# EAGLE schematic Aktivfilter (EAGLE 9.6.2)
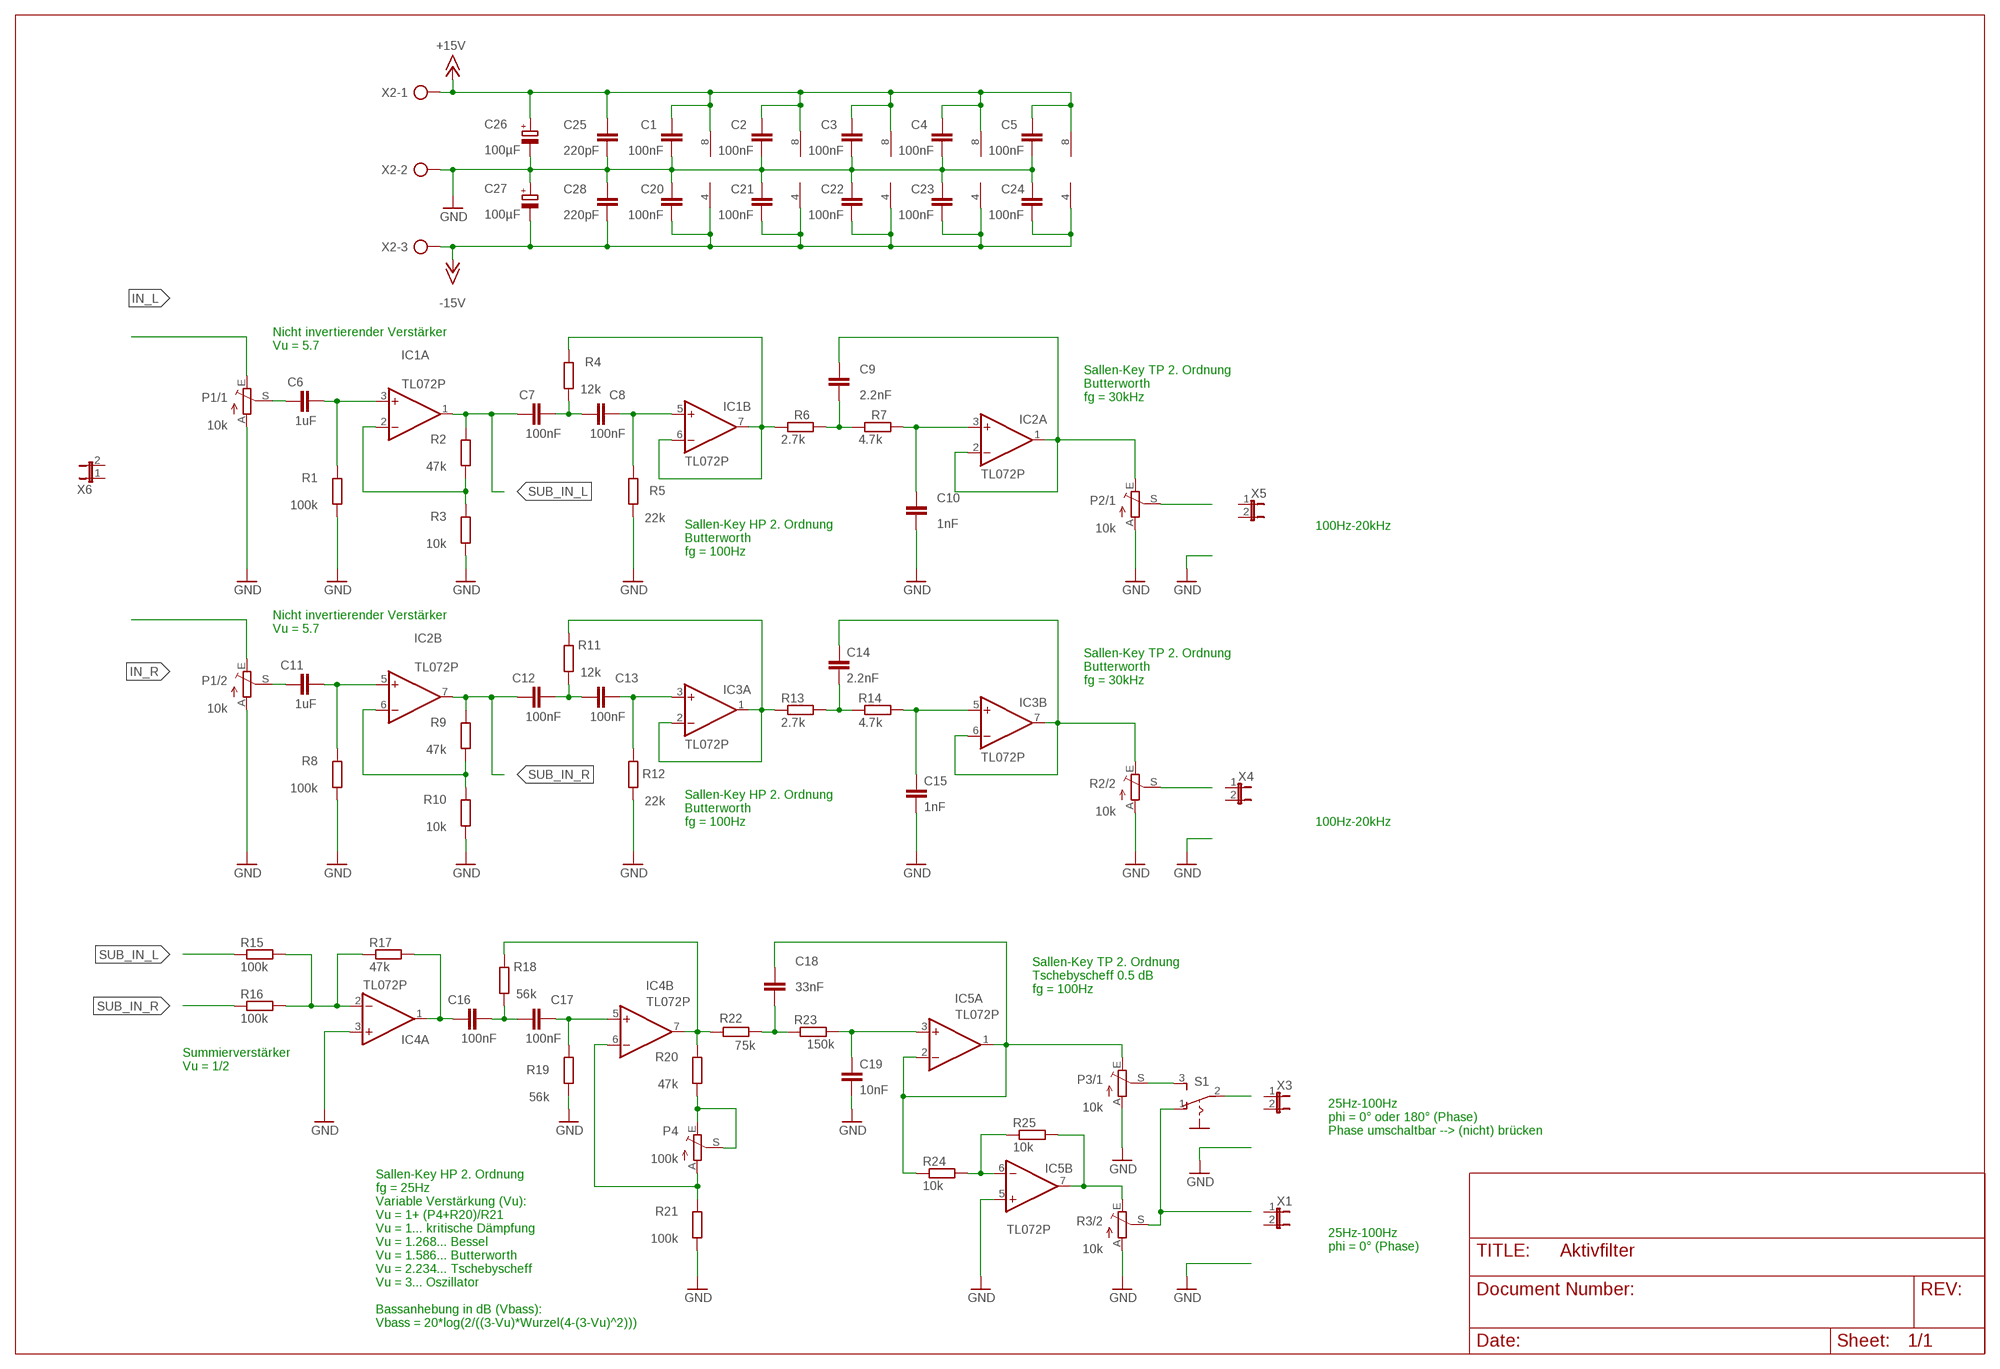
[diagram p0: schematic, sheet 1]

## Parts
C1  100nF  C-EU025-025X050  [C025-025X050]
C2  100nF  C-EU025-025X050  [C025-025X050]
C3  100nF  C-EU025-025X050  [C025-025X050]
C4  100nF  C-EU025-025X050  [C025-025X050]
C5  100nF  C-EU025-025X050  [C025-025X050]
C6  1uF  C-EU025-025X050  [C025-025X050]
C7  100nF  C-EU025-025X050  [C025-025X050]
C8  100nF  C-EU025-025X050  [C025-025X050]
C9  2.2nF  C-EU025-025X050  [C025-025X050]
C10  1nF  C-EU025-025X050  [C025-025X050]
C11  1uF  C-EU025-025X050  [C025-025X050]
C12  100nF  C-EU025-025X050  [C025-025X050]
C13  100nF  C-EU025-025X050  [C025-025X050]
C14  2.2nF  C-EU025-025X050  [C025-025X050]
C15  1nF  C-EU025-025X050  [C025-025X050]
C16  100nF  C-EU050-025X075  [C050-025X075]
C17  100nF  C-EU025-025X050  [C025-025X050]
C18  33nF  C-EU025-025X050  [C025-025X050]
C19  10nF  C-EU025-025X050  [C025-025X050]
C20  100nF  C-EU025-025X050  [C025-025X050]
C21  100nF  C-EU025-025X050  [C025-025X050]
C22  100nF  C-EU025-025X050  [C025-025X050]
C23  100nF  C-EU025-025X050  [C025-025X050]
C24  100nF  C-EU025-025X050  [C025-025X050]
C25  220pF  C-EU025-025X050  [C025-025X050]
C26  100µF  CPOL-EUE2.5-6  [E2,5-6]
C27  100µF  CPOL-EUE2.5-6  [E2,5-6]
C28  220pF  C-EU025-025X050  [C025-025X050]
IC1  TL072P  [DIL08]
IC2  TL072P  [DIL08]
IC3  TL072P  [DIL08]
IC4  TL072P  [DIL08]
IC5  TL072P  [DIL08]
P1/1  10k  TRIM_EU-B64Y  [B64Y]
P1/2  10k  TRIM_EU-B64Y  [B64Y]
P2/1  10k  TRIM_EU-B64Y  [B64Y]
P3/1  10k  TRIM_EU-B64Y  [B64Y]
P4  100k  TRIM_EU-B64Y  [B64Y]
R1  100k  R-EU_0207/10  [0207/10]
R2  47k  R-EU_0207/10  [0207/10]
R2/2  10k  TRIM_EU-B64Y  [B64Y]
R3  10k  R-EU_0207/10  [0207/10]
R3/2  10k  TRIM_EU-B64Y  [B64Y]
R4  12k  R-EU_0207/10  [0207/10]
R5  22k  R-EU_0207/10  [0207/10]
R6  2.7k  R-EU_0207/10  [0207/10]
R7  4.7k  R-EU_0207/10  [0207/10]
R8  100k  R-EU_0207/7  [0207/7]
R9  47k  R-EU_0207/7  [0207/7]
R10  10k  R-EU_0207/10  [0207/10]
R11  12k  R-EU_0207/10  [0207/10]
R12  22k  R-EU_0207/10  [0207/10]
R13  2.7k  R-EU_0207/10  [0207/10]
R14  4.7k  R-EU_0207/10  [0207/10]
R15  100k  R-EU_0207/10  [0207/10]
R16  100k  R-EU_0207/10  [0207/10]
R17  47k  R-EU_0207/10  [0207/10]
R18  56k  R-EU_0207/10  [0207/10]
R19  56k  R-EU_0207/7  [0207/7]
R20  47k  R-EU_0207/10  [0207/10]
R21  100k  R-EU_0207/10  [0207/10]
R22  75k  R-EU_0207/7  [0207/7]
R23  150k  R-EU_0207/10  [0207/10]
R24  10k  R-EU_0207/10  [0207/10]
R25  10k  R-EU_0207/10  [0207/10]
S1  255SB  [255SB]
X1  JMP2  [JMP2]
X2  AK300/3  [AK300/3]
X3  JMP2  [JMP2]
X4  JMP2  [JMP2]
X5  JMP2  [JMP2]
X6  JMP2  [JMP2]

## Nets
+15V: C1.1 C2.1 C3.1 C4.1 C5.1 C25.1 C26.+ IC1.8(P:V+) IC2.8(P:V+) IC3.8(P:V+) IC4.8(P:V+) IC5.8(P:V+) X2.1
-15V: C20.2 C21.2 C22.2 C23.2 C24.2 C27.- C28.2 IC1.4(P:V-) IC2.4(P:V-) IC3.4(P:V-) IC4.4(P:V-) IC5.4(P:V-) X2.3
GND: C1.2 C2.2 C3.2 C4.2 C5.2 C10.2 C15.2 C19.2 C20.1 C21.1 C22.1 C23.1 C24.1 C25.2 C26.- C27.+ C28.1 IC4.3(A:+IN) IC5.5(B:+IN) P1/1.A P1/2.A P2/1.A P3/1.A R1.1 R2/2.A R3.1 R3/2.A R5.1 R8.1 R10.1 R12.1 R19.1 R21.1 X2.2
IN_L: P1/1.E
IN_R: P1/2.E
N$1: P3/1.S S1.3(S)
N$2: R3/2.S S1.1(O)
N$3: S1.2(P)
N$26: C6.1 P1/1.S
N$28: C6.2 IC1.3(A:+IN) R1.2
N$31: IC1.2(A:-IN) R2.1 R3.2
N$33: IC1.6(B:-IN) IC1.7(B:OUT) R4.2 R6.1
N$34: C8.2 IC1.5(B:+IN) R5.2
N$35: C7.2 C8.1 R4.1
N$36: IC4.2(A:-IN) R15.2 R16.2 R17.1
N$37: C9.2 R6.2 R7.1
N$38: C10.1 IC2.3(A:+IN) R7.2
N$39: C9.1 IC2.1(A:OUT) IC2.2(A:-IN) P2/1.E
N$40: C16.1 IC4.1(A:OUT) R17.2
N$41: C11.1 P1/2.S
N$42: C11.2 IC2.5(B:+IN) R8.2
N$43: IC2.6(B:-IN) R9.1 R10.2
N$45: IC3.1(A:OUT) IC3.2(A:-IN) R11.2 R13.1
N$46: C13.2 IC3.3(A:+IN) R12.2
N$47: C12.2 C13.1 R11.1
N$48: C14.2 R13.2 R14.1
N$49: C15.1 IC3.5(B:+IN) R14.2
N$50: C14.1 IC3.6(B:-IN) IC3.7(B:OUT) R2/2.E
N$51: C16.2 C17.1 R18.1
N$52: C17.2 IC4.5(B:+IN) R19.2
N$53: IC4.7(B:OUT) R18.2 R20.2 R22.2
N$54: IC4.6(B:-IN) P4.A R21.2
N$55: IC5.6(B:-IN) R24.2 R25.1
N$57: P4.E P4.S R20.1
N$59: C19.1 IC5.3(A:+IN) R23.2
N$60: C18.2 R22.1 R23.1
OUT_L: P2/1.S
OUT_R: R2/2.S
SUB_IN_L: C7.1 IC1.1(A:OUT) R2.2 R15.1
SUB_IN_R: C12.1 IC2.7(B:OUT) R9.2 R16.1
SUB_OUT: IC5.7(B:OUT) R3/2.E R25.2
SUB_OUT-180: C18.1 IC5.1(A:OUT) IC5.2(A:-IN) P3/1.E R24.1
Unconnected: X1.1 X1.2 X3.1 X3.2 X4.1 X4.2 X5.1 X5.2 X6.1 X6.2

## Notes on the sheet
- Nicht invertierender Verstärker
  Vu = 5.7
- Sallen-Key TP 2. Ordnung
  Butterworth
  fg = 30kHz
- 100Hz-20kHz
- Sallen-Key HP 2. Ordnung
  Butterworth
  fg = 100Hz
- Nicht invertierender Verstärker
  Vu = 5.7
- Sallen-Key TP 2. Ordnung
  Butterworth
  fg = 30kHz
- Sallen-Key HP 2. Ordnung
  Butterworth
  fg = 100Hz
- 100Hz-20kHz
- Sallen-Key TP 2. Ordnung
  Tschebyscheff 0.5 dB
  fg = 100Hz
- Summierverstärker
  Vu = 1/2
- 25Hz-100Hz
  phi = 0° oder 180° (Phase) 
  Phase umschaltbar --> (nicht) brücken
- 25Hz-100Hz
  phi = 0° (Phase)
- Sallen-Key HP 2. Ordnung
  fg = 25Hz
  Variable Verstärkung (Vu): 
  Vu = 1+ (P4+R20)/R21
  Vu = 1... kritische Dämpfung
  Vu = 1.268... Bessel
  Vu = 1.586... Butterworth
  Vu = 2.234... Tschebyscheff
  Vu = 3... Oszillator
  
  Bassanhebung in dB (Vbass):
  Vbass = 20*log(2/((3-Vu)*Wurzel(4-(3-Vu)^2)))

## Library data of the parts
C1-C5 C16-C25 C28 = rcl:C-EU: CAPACITOR, European symbol
C6-C15 = resistor:C-EU: CAPACITOR, European symbol
C26 C27 = rcl:CPOL-EU: POLARIZED CAPACITOR, European symbol
IC1-IC5 = linear:TL072: OP AMP
P1/1 P1/2 P2/1 P3/1 P4 R2/2 R3/2 = pot:TRIM_EU-: POTENTIOMETER
R1-R7 R10-R14 = resistor:R-EU_: RESISTOR, European symbol
R8 R9 R15-R25 = rcl:R-EU_: RESISTOR, European symbol
S1 = switch:255SB: SLIDING SWITCH Distributor Buerklin, 11G810
X1 X3-X6 = 0_HTL_elektro:JMP2: Jumper 2-polig
X2 = con-ptr500:AK300/3: CONNECTOR; OC_FARNELL: unknown; OC_NEWARK: unknown